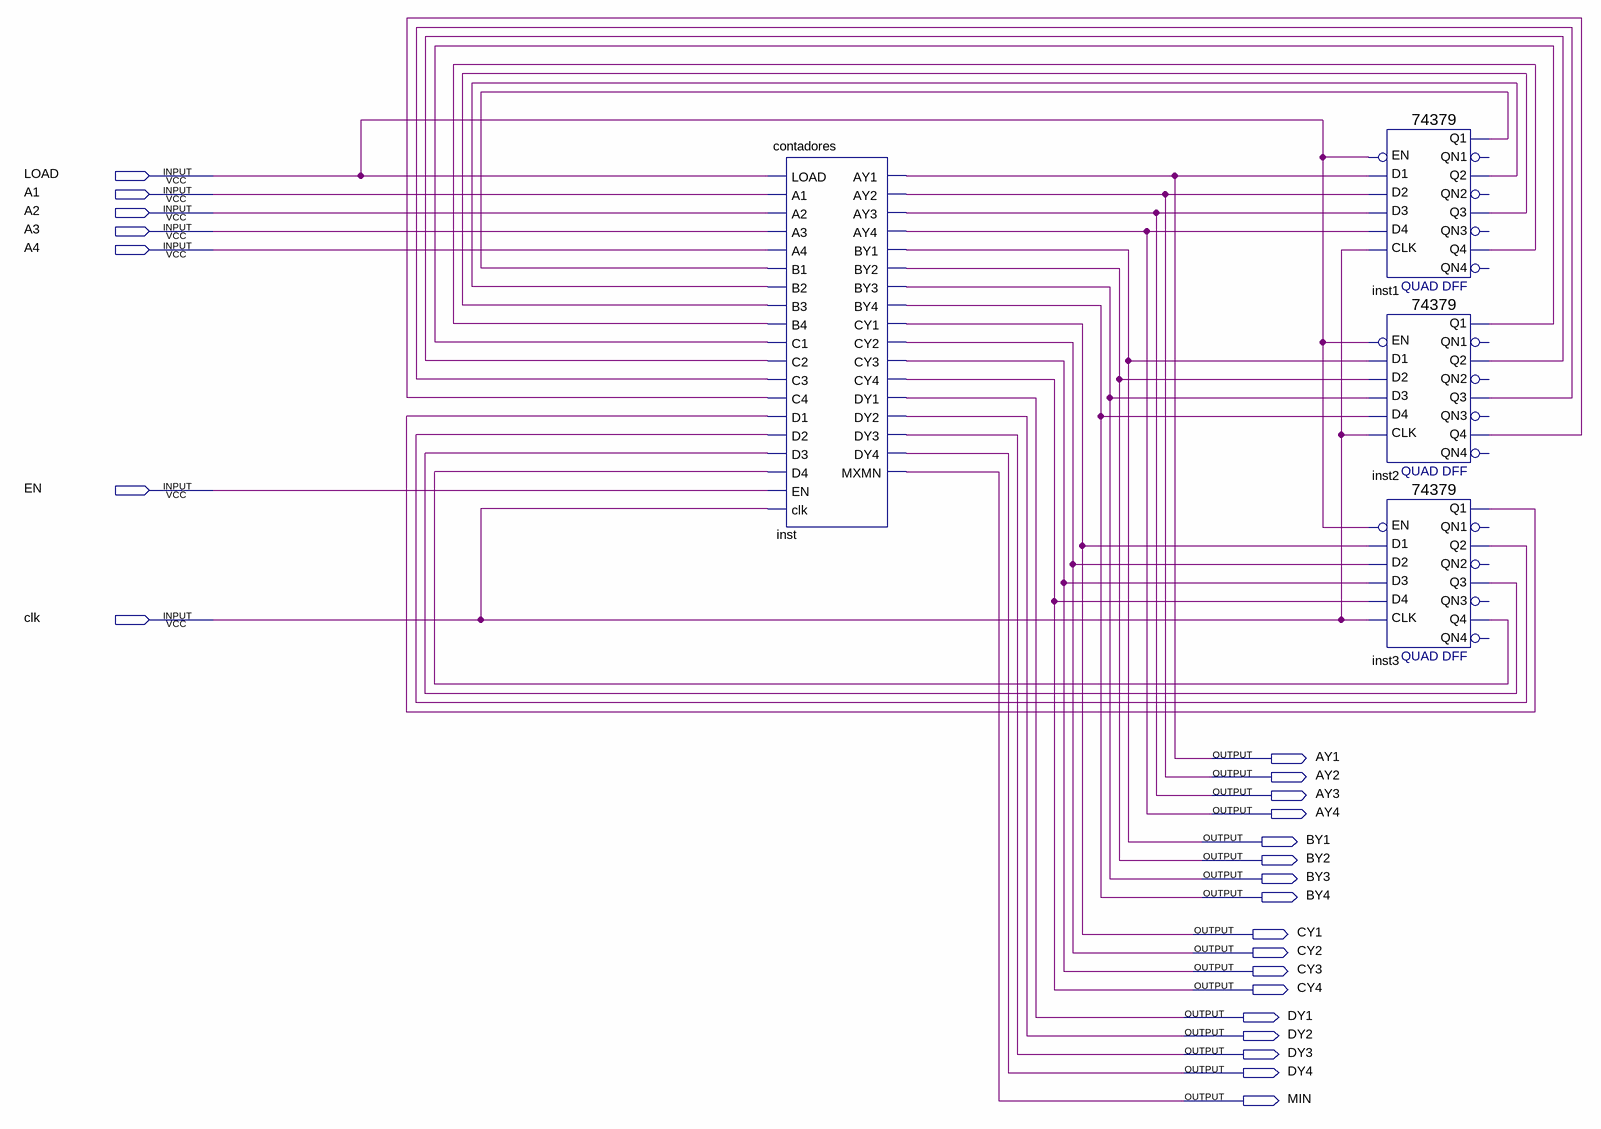
[diagram p0: schematic sheet]
// Quartus schematic cont_regis.bdf as structural Verilog: 4 symbols, 24 pins
module cont_regis (
  input  LOAD,
  input  A1,
  input  A2,
  input  A3,
  input  A4,
  input  EN,
  input  clk,
  output AY1,
  output AY2,
  output AY3,
  output AY4,
  output BY1,
  output BY2,
  output BY3,
  output BY4,
  output CY1,
  output CY2,
  output CY3,
  output CY4,
  output DY1,
  output DY2,
  output DY3,
  output DY4,
  output MIN
);

  wire inst1_q1, inst1_q2, inst1_q3, inst1_q4, inst2_q1, inst2_q2, inst2_q3, inst2_q4, inst3_q1, inst3_q2,
       inst3_q3, inst3_q4;

  contadores inst (
    .LOAD(LOAD), .A1(A1), .A2(A2), .A3(A3), .A4(A4), .B1(inst1_q1), .B2(inst1_q2), .B3(inst1_q3),
    .B4(inst1_q4), .C1(inst2_q1), .C2(inst2_q2), .C3(inst2_q3), .C4(inst2_q4), .D1(inst3_q1), .D2(inst3_q2),
    .D3(inst3_q3), .D4(inst3_q4), .EN(EN), .clk(clk), .AY1(AY1), .AY2(AY2), .AY3(AY3), .AY4(AY4), .BY1(BY1),
    .BY2(BY2), .BY3(BY3), .BY4(BY4), .CY1(CY1), .CY2(CY2), .CY3(CY3), .CY4(CY4), .DY1(DY1), .DY2(DY2),
    .DY3(DY3), .DY4(DY4), .MXMN(MIN));
  \74379  inst1 (
    .D1(AY1), .EN(LOAD), .D2(AY2), .D3(AY3), .CLK(clk), .D4(AY4), .Q4(inst1_q4), .Q3(inst1_q3),
    .Q2(inst1_q2), .Q1(inst1_q1));  // open: QN4, QN2, QN3, QN1
  \74379  inst2 (
    .D1(BY1), .EN(LOAD), .D2(BY2), .D3(BY3), .CLK(clk), .D4(BY4), .Q4(inst2_q4), .Q3(inst2_q3),
    .Q2(inst2_q2), .Q1(inst2_q1));  // open: QN4, QN2, QN3, QN1
  \74379  inst3 (
    .D1(CY1), .EN(LOAD), .D2(CY2), .D3(CY3), .CLK(clk), .D4(CY4), .Q4(inst3_q4), .Q3(inst3_q3),
    .Q2(inst3_q2), .Q1(inst3_q1));  // open: QN4, QN2, QN3, QN1
endmodule
